# Altium schematic sheet Sheet1.SchDoc
size A4
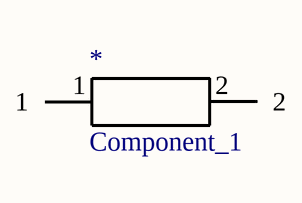
[diagram p0: Sheet1.SchDoc]

## Parts
*  Component_1  [PCBComponent_1]

## Nets

Not connected (* = marked no-connect by the designer): * 1 2